# Altium schematic sheet AS_Node_Connectors.SchDoc
size A2
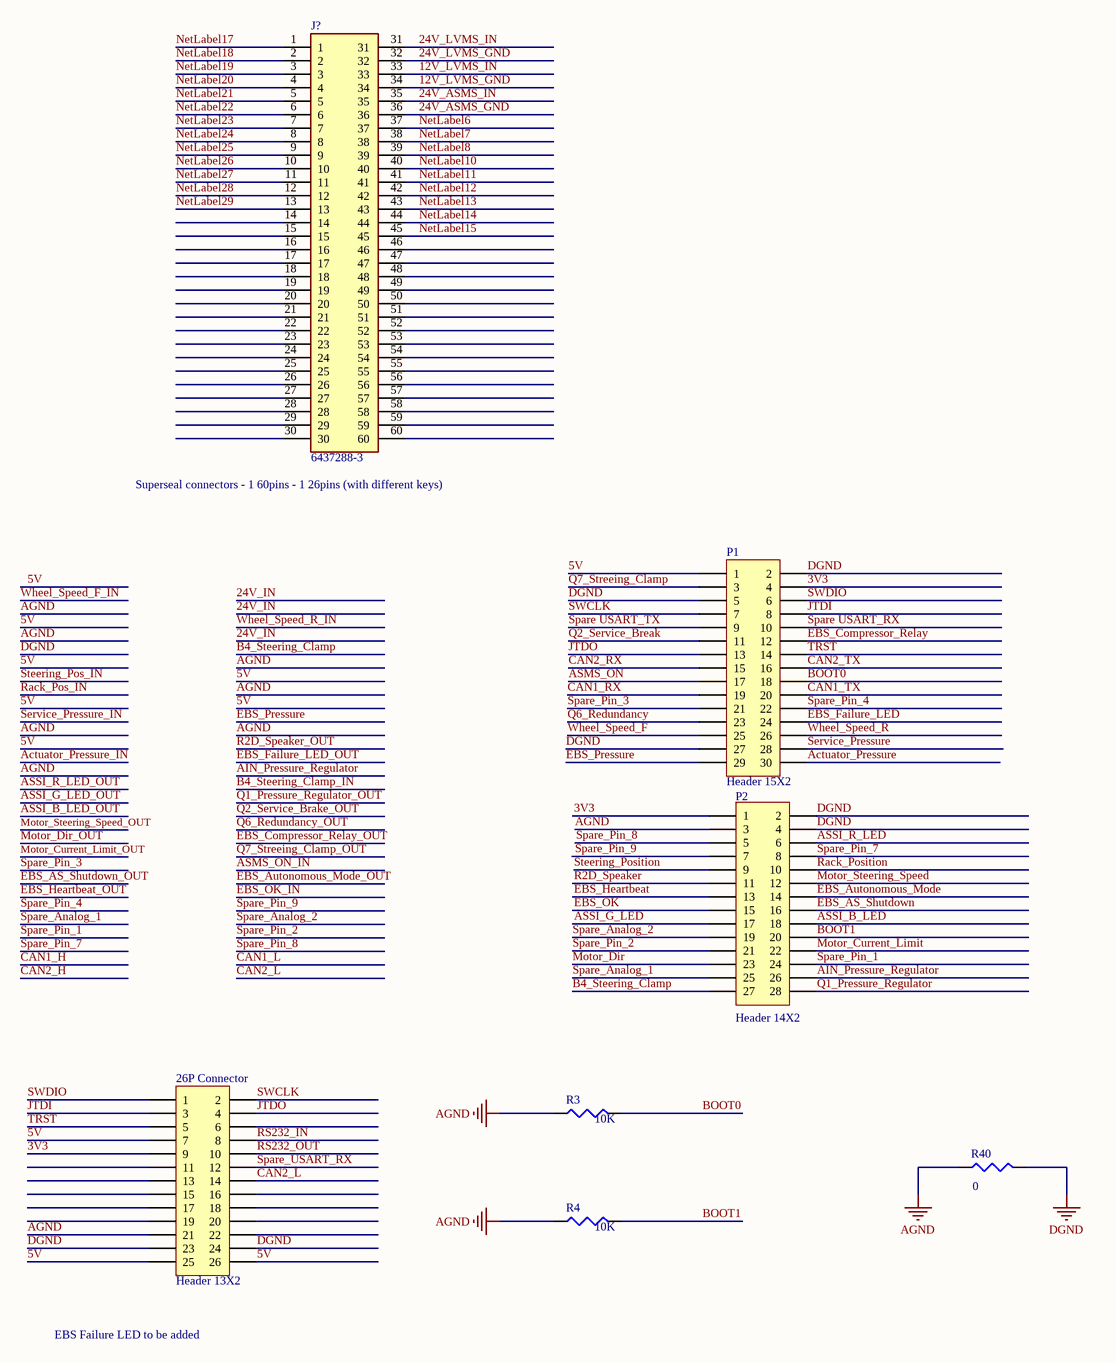
[diagram p0: AS_Node_Connectors.SchDoc]

## Parts
26P_Connector  Header 13X2  [CONN26_9-6437287]
J?  6437288-3  [6437288-3]
P1  Header 15X2  [30_connector_male]
P2  Header 14X2  [28 _connector_male]
R3  value 10K  [SMD-0805-RES]  (hidden comment: Res3)
R4  value 10K  [SMD-0805-RES]  (hidden comment: Res3)
R40  value 0  [SMD-0805-RES]  (hidden comment: Res3)

## Nets
AGND: 26P_Connector.21 P2.3 R3.1 R4.1 R40.1
DGND: 26P_Connector.23 26P_Connector.24 P1.2 P1.5 P1.27 P2.2 P2.4 R40.2
3V3: 26P_Connector.9 P1.4 P2.1
5V: 26P_Connector.7 26P_Connector.25 26P_Connector.26 P1.1
12V_LVMS_GND: J?.34
12V_LVMS_IN: J?.33
24V_ASMS_GND: J?.36
24V_ASMS_IN: J?.35
24V_LVMS_GND: J?.32
24V_LVMS_IN: J?.31
Actuator_Pressure: P1.30
AIN_Pressure_Regulator: P2.26
ASMS_ON: P1.17
ASSI_B_LED: P2.18
ASSI_G_LED: P2.17
ASSI_R_LED: P2.6
B4_Steering_Clamp: P2.27
BOOT0: P1.18 R3.2
BOOT1: P2.20 R4.2
CAN1_RX: P1.19
CAN1_TX: P1.20
CAN2_L: 26P_Connector.14
CAN2_RX: P1.15
CAN2_TX: P1.16
EBS_AS_Shutdown: P2.16
EBS_Autonomous_Mode: P2.14
EBS_Compressor_Relay: P1.12
EBS_Failure_LED: P1.24
EBS_Heartbeat: P2.13
EBS_OK: P2.15
EBS_Pressure: P1.29
JTDI: 26P_Connector.3 P1.8
JTDO: 26P_Connector.4 P1.13
Motor_Current_Limit: P2.22
Motor_Dir: P2.23
Motor_Steering_Speed: P2.12
NetLabel6: J?.37
NetLabel7: J?.38
NetLabel8: J?.39
NetLabel10: J?.40
NetLabel11: J?.41
NetLabel12: J?.42
NetLabel13: J?.43
NetLabel14: J?.44
NetLabel15: J?.45
NetLabel17: J?.1
NetLabel18: J?.2
NetLabel19: J?.3
NetLabel20: J?.4
NetLabel21: J?.5
NetLabel22: J?.6
NetLabel23: J?.7
NetLabel24: J?.8
NetLabel25: J?.9
NetLabel26: J?.10
NetLabel27: J?.11
NetLabel28: J?.12
NetLabel29: J?.13
Q1_Pressure_Regulator: P2.28
Q2_Service_Break: P1.11
Q6_Redundancy: P1.23
Q7_Streeing_Clamp: P1.3
R2D_Speaker: P2.11
Rack_Position: P2.10
RS232_IN: 26P_Connector.8
RS232_OUT: 26P_Connector.10
Service_Pressure: P1.28
Spare USART_RX: P1.10
Spare USART_TX: P1.9
Spare_Analog_1: P2.25
Spare_Analog_2: P2.19
Spare_Pin_1: P2.24
Spare_Pin_2: P2.21
Spare_Pin_3: P1.21
Spare_Pin_4: P1.22
Spare_Pin_7: P2.8
Spare_Pin_8: P2.5
Spare_Pin_9: P2.7
Spare_USART_RX: 26P_Connector.12
Steering_Position: P2.9
SWCLK: 26P_Connector.2 P1.7
SWDIO: 26P_Connector.1 P1.6
TRST: 26P_Connector.5 P1.14
Wheel_Speed_F: P1.25
Wheel_Speed_R: P1.26

Not connected (* = marked no-connect by the designer): 26P_Connector 6 11 13 15 16 17 18 19 20 22; J? 14 15 16 17 18 19 20 21 22 23 24 25 26 27 28 29 30 46 47 48 49 50 51 52 53 54 55 56 57 58 59 60

## Notes on the sheet
- (near J?) Superseal connectors - 1 60pins - 1 26pins (with different keys)
- EBS Failure LED to be added

## Library data of the parts
26P_Connector = Header 13X2: Header, 13-Pin, Dual row; LatestRevisionDate: 17-Jul-2002; LatestRevisionNote: Re-released for DXP Platform.; Publisher: Altium Limited
J? = 6437288-3: Connector; Manufacturer_Name: TE Connectivity; Datasheet Link: https://componentsearchengine.com/Datasheets/1/6437288-3.pdf; Mouser2 Part Number: 571-6437288-3; Mouser2 Price/Stock: https://www.mouser.com/Search/Refine.aspx?Keyword=571-6437288-3; Manufacturer_Part_Number: 6437288-3
P1 = Header 15X2: Header, 15-Pin, Dual row; Manufacturer: Wurth Electronics Inc; Manufacturer Part Number: 61303021121; Connector Type: Header, Unshrouded; Number of Positions: 30; Number of Positions Loaded: All; Pitch: 0.100" (2.54mm); Supplier 1: Digi-Key; Supplier Part Number 1: 732-5306-ND; RoHS: RoHS Compliant; Category: Connectors, Interconnects; Stock 1: 127; Pricing 1: 1=1.57, 100=1.404, 500=1.188, 10000=0.702 (USD); Packaging: Bulk; Part Status: Active; Contact Type: Male Pin; Number of Rows: 2; Row Spacing: 0.100" (2.54mm); Contact Mating Length: 0.236" (6.00mm); Mounting Type: Through Hole; Termination: Solder; Fastening Type: -; Features: -; Contact Finish: Gold; Contact Finish Thickness: -; Color: Black; ComponentLink1URL: http://katalog.we-online.de/em/datasheet/6130xx21121.pdf; ComponentLink1Description: http://katalog.we-online.de/em/datasheet/6130xx21121.pdf
P2 = Header 14X2: Header, 14-Pin, Dual row; Manufacturer: Wurth Electronics Inc; Manufacturer Part Number: 61302821121; Connector Type: Header, Unshrouded; Number of Positions: 28; Number of Positions Loaded: All; Pitch: 0.100" (2.54mm); Supplier 1: Digi-Key; Supplier Part Number 1: 732-5305-ND; RoHS: RoHS Compliant; Category: Connectors, Interconnects; Stock 1: 2; Pricing 1: 1=1.49, 100=1.3338, 500=1.1286, 10000=0.6669 (USD); Packaging: Bulk; Part Status: Active; Contact Type: Male Pin; Number of Rows: 2; Row Spacing: 0.100" (2.54mm); Contact Mating Length: 0.236" (6.00mm); Mounting Type: Through Hole; Termination: Solder; Fastening Type: -; Features: -; Contact Finish: Gold; Contact Finish Thickness: -; Color: Black; ComponentLink1URL: http://katalog.we-online.de/em/datasheet/6130xx21121.pdf; ComponentLink1Description: http://katalog.we-online.de/em/datasheet/6130xx21121.pdf
R3 R4 R40 = Res3: Resistor; Published: 8-Jun-2000; LatestRevisionDate: 29-May-2009; LatestRevisionNote: IPC-7351 Footprint Added.; PackageReference: J1-0603; Publisher: Altium Limited; PackageDescription: Chip Resistor